# Altium schematic sheet LSWM_10_STM32L0_ADXL345.SchDoc
size A4
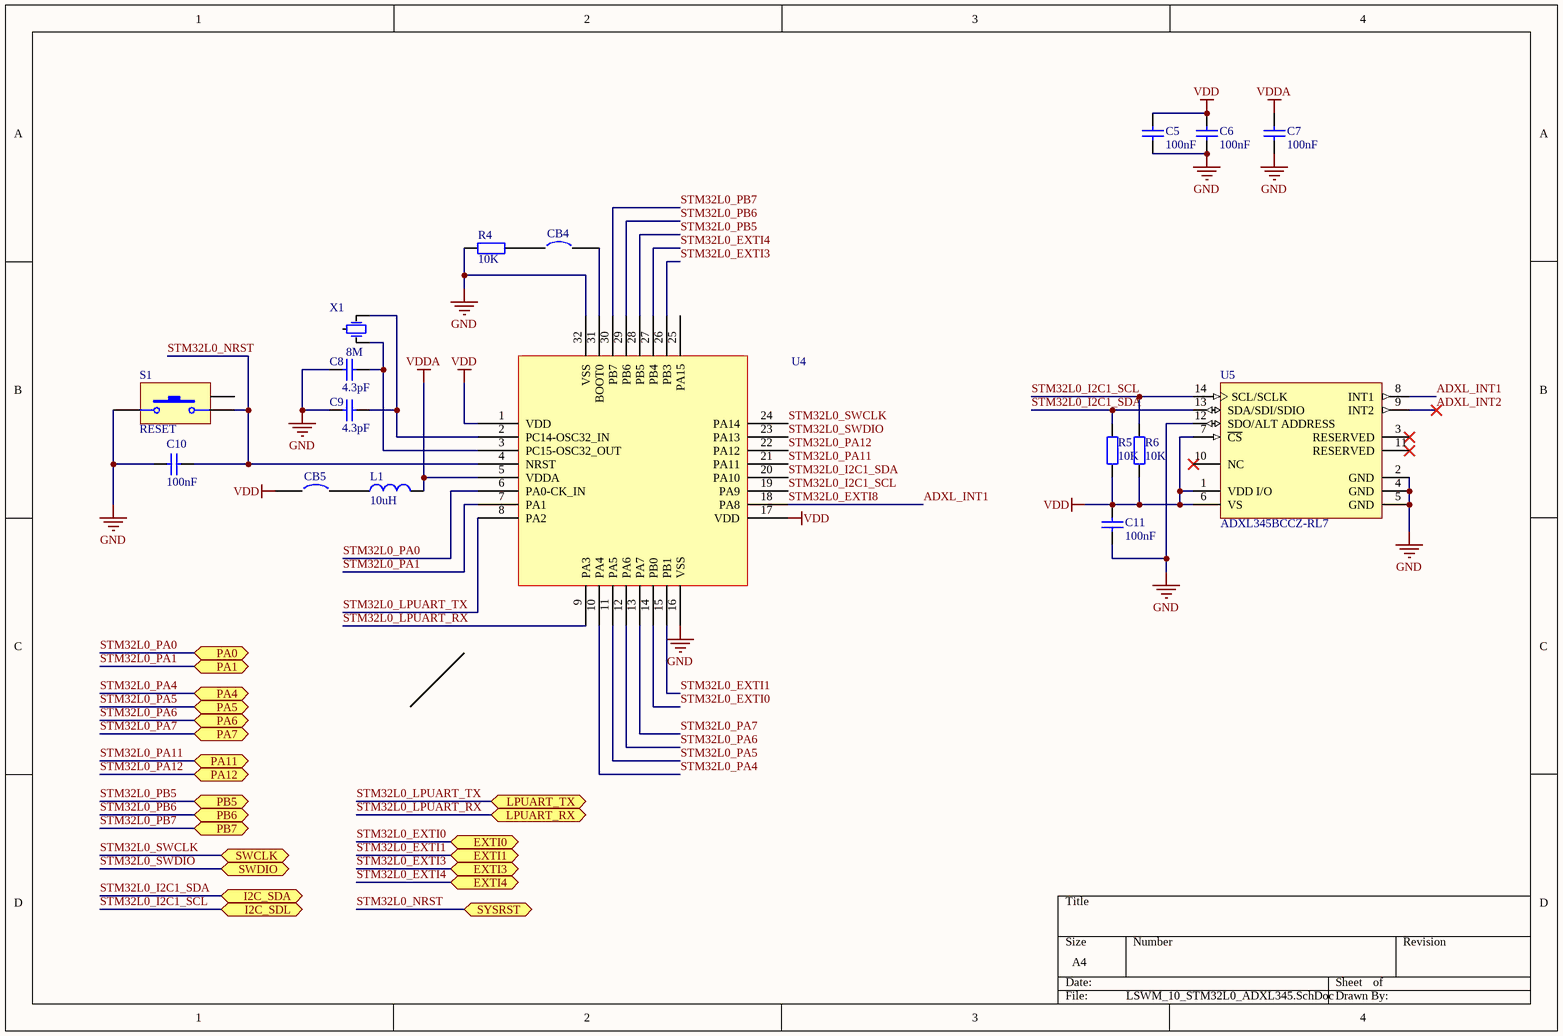
[diagram p0: LSWM_10_STM32L0_ADXL345.SchDoc]

## Parts
C5  value 100nF  [C-RAD-0603]  (hidden comment: Cap)
C6  value 100nF  [C-RAD-0603]  (hidden comment: Cap)
C7  value 100nF  [C-RAD-0603]  (hidden comment: Cap)
C8  value 4.3pF  [C-RAD-0603]  (hidden comment: Cap)
C9  value 4.3pF  [C-RAD-0603]  (hidden comment: Cap)
C10  value 100nF  [C-RAD-0603]  (hidden comment: Cap)
C11  value 100nF  [C-RAD-0603]  (hidden comment: Cap)
CB4  Circuit Breaker  [SB-0805]  (value not drawn)
CB5  Circuit Breaker  [SB-0805]  (value not drawn)
L1  value 10uH  [0805-1]  (hidden comment: Inductor)
R4  value 10K  [0603-1]  (hidden comment: Res1)
R5  value 10K  [0603-1]  (hidden comment: Res1)
R6  value 10K  [0603-1]  (hidden comment: Res1)
S1  RESET  [BTN_2_4_35]
U4  STM32L031K6  [TQFP80P900X900X160-32N]  (value not drawn)
U5  ADXL345BCCZ-RL7  [LGA80P300X500-14N]
X1  value 8M  [X-2X6C - duplicate]  (hidden comment: XTAL_SM)

## Ports
EXTI0 (bidir), EXTI1 (bidir), EXTI3 (bidir), EXTI4 (bidir), I2C_SDA (bidir), I2C_SDL (bidir), LPUART_RX (bidir), LPUART_TX (bidir), PA0 (bidir), PA1 (bidir), PA4 (bidir), PA5 (bidir), PA6 (bidir), PA7 (bidir), PA11 (bidir), PA12 (bidir), PB5 (bidir), PB6 (bidir), PB7 (bidir), SWCLK (bidir), SWDIO (bidir), SYSRST (bidir)

## Nets
GND: C5.2 C6.1 C7.1 C8.1 C9.1 C10.1 C11.1 R4.1 S1.1 U4.16(VSS) U4.32(VSS) U5.2(GND) U5.4(GND) U5.5(GND) U5.12(SDO/ALT_ADDRESS)
VDD: C5.1 C6.2 C11.2 CB5.1 R5.1 R6.1 U4.1(VDD) U4.17(VDD) U5.1(VDD_I/O) U5.6(VS) U5.7(~{CS})
VDDA: C7.2 L1.2 U4.5(VDDA)
ADXL_INT1: U4.18(PA8) U5.8(INT1)  [also labelled STM32L0_EXTI8]
ADXL_INT2: U5.9(INT2)
STM32L0_EXTI0: U4.14(PB0) ; port EXTI0
STM32L0_EXTI1: U4.15(PB1) ; port EXTI1
STM32L0_EXTI3: U4.26(PB3) ; port EXTI3
STM32L0_EXTI4: U4.27(PB4) ; port EXTI4
STM32L0_I2C1_SCL: R6.2 U4.19(PA9) U5.14(SCL/SCLK) ; port I2C_SDL
STM32L0_I2C1_SDA: R5.2 U4.20(PA10) U5.13(SDA/SDI/SDIO) ; port I2C_SDA
STM32L0_LPUART_RX: U4.9(PA3) ; port LPUART_RX
STM32L0_LPUART_TX: U4.8(PA2) ; port LPUART_TX
STM32L0_NRST: C10.2 S1.2 U4.4(NRST) ; port SYSRST
STM32L0_PA0: U4.6(PA0-CK_IN) ; port PA0
STM32L0_PA1: U4.7(PA1) ; port PA1
STM32L0_PA4: U4.10(PA4) ; port PA4
STM32L0_PA5: U4.11(PA5) ; port PA5
STM32L0_PA6: U4.12(PA6) ; port PA6
STM32L0_PA7: U4.13(PA7) ; port PA7
STM32L0_PA11: U4.21(PA11) ; port PA11
STM32L0_PA12: U4.22(PA12) ; port PA12
STM32L0_PB5: U4.28(PB5) ; port PB5
STM32L0_PB6: U4.29(PB6) ; port PB6
STM32L0_PB7: U4.30(PB7) ; port PB7
STM32L0_SWCLK: U4.24(PA14) ; port SWCLK
STM32L0_SWDIO: U4.23(PA13) ; port SWDIO
NetC8_2: C8.2 U4.3(PC15-OSC32_OUT) X1.2(OSC2)
NetC9_2: C9.2 U4.2(PC14-OSC32_IN) X1.1(OSC1)
NetCB4_1: CB4.1 R4.2
NetCB4_2: CB4.2 U4.31(BOOT0)
NetCB5_2: CB5.2 L1.1

Not connected (* = marked no-connect by the designer): S1 3; U4 25(PA15); U5 3(RESERVED)* 10(NC)* 11(RESERVED)*; X1 3

## Library data of the parts
C5-C11 = Cap: 无极性电容; Published: 8-Jun-2000; LatestRevisionDate: 17-Jul-2002; LatestRevisionNote: Re-released for DXP Platform.; PackageReference: RAD-0.3; Publisher: Altium Limited
L1 = Inductor: 电感; Code_IEC: 1005; Published: 8-Jun-2000; LatestRevisionDate: 17-Jul-2002; LatestRevisionNote: Re-released for DXP Platform.; PackageReference: 0402-A; Publisher: Altium Limited; Code_JEITA: 0402
R4-R6 = Res1: 贴片电阻; Published: 8-Jun-2000; LatestRevisionDate: 17-Jul-2002; LatestRevisionNote: Re-released for DXP Platform.; PackageReference: AXIAL-0.4; Publisher: Altium Limited
S1 = SW-PB: 微动开关; Published: 24-Mar-1999; LatestRevisionDate: 17-Jul-2002; LatestRevisionNote: Re-released for DXP Platform.; PackageReference: SPST-2; Publisher: Altium Limited
U5 = ADI-ADXL34X-CC-14-1: 3-Axis, +/-2 g / +/-4 g / +/-8 g / +/-16 g Digital Accelerometer with Digital Output, 1.6 KHz BW, Industrial, 14-pin LGA, Reel
X1 = XTAL_SM: 圆柱晶振; Published: 8-Jun-2000; LatestRevisionDate: 17-Jul-2002; LatestRevisionNote: Re-released for DXP Platform.; PackageReference: R38; Publisher: Altium Limited
CB4 CB5 = Circuit Breaker: Published: 24-Mar-1999; LatestRevisionDate: 17-Jul-2002; LatestRevisionNote: Re-released for DXP Platform.; PackageReference: SPST-2; Publisher: Altium Limited; PackageDescription: Switch; 2 Leads